# Altium schematic sheet [04] - SERVO DRIVER.SchDoc
size A4; DocumentNumber: 4; SheetNumber: 4; SheetTotal: 5; Folha: Servo Driver
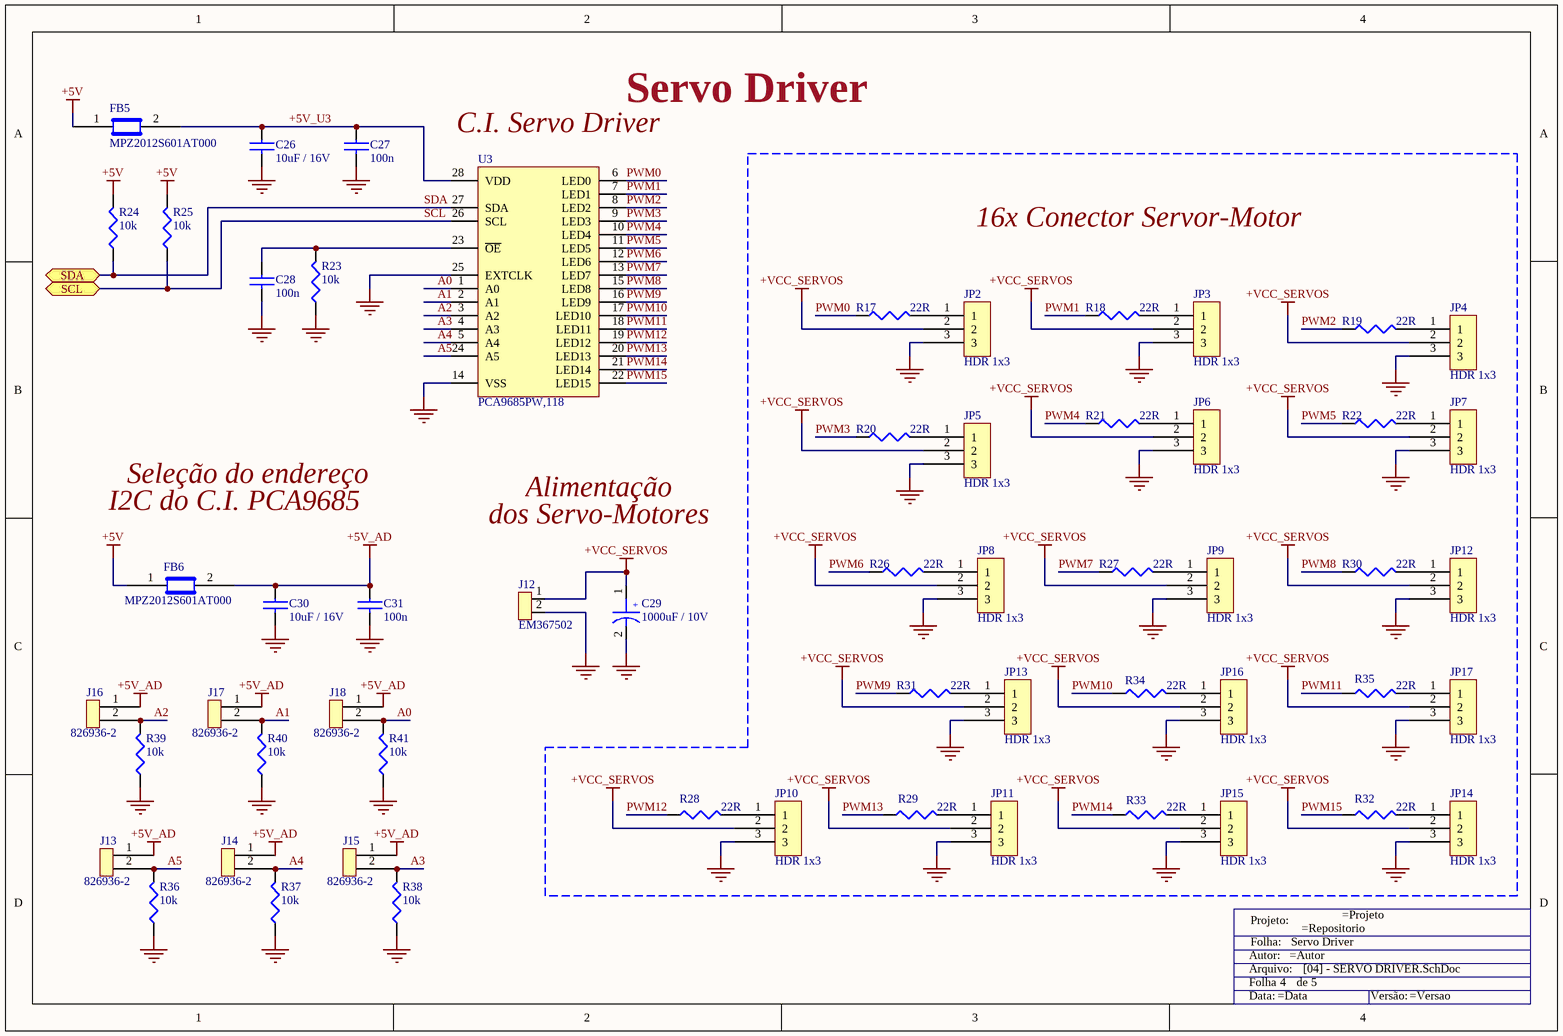
[diagram p0: [04] - SERVO DRIVER.SchDoc]

## Parts
C26  10uF / 16V  [C0805]
C27  100n  [C0805]
C28  100n  [C0805]
C29  1000uF / 10V  [CAP_EL_10MMX16]
C30  10uF / 16V  [C0805]
C31  100n  [C0805]
FB5  MPZ2012S601AT000  [C0805]
FB6  MPZ2012S601AT000  [C0805]
J12  EM367502  [2_Pins_Fixed_Terminal]
J13  826936-2  [HDR_1X2_2.54MM]
J14  826936-2  [HDR_1X2_2.54MM]
J15  826936-2  [HDR_1X2_2.54MM]
J16  826936-2  [HDR_1X2_2.54MM]
J17  826936-2  [HDR_1X2_2.54MM]
J18  826936-2  [HDR_1X2_2.54MM]
JP2  HDR 1x3  [Hdr_1x3_2.54mm]
JP3  HDR 1x3  [Hdr_1x3_2.54mm]
JP4  HDR 1x3  [Hdr_1x3_2.54mm]
JP5  HDR 1x3  [Hdr_1x3_2.54mm]
JP6  HDR 1x3  [Hdr_1x3_2.54mm]
JP7  HDR 1x3  [Hdr_1x3_2.54mm]
JP8  HDR 1x3  [Hdr_1x3_2.54mm]
JP9  HDR 1x3  [Hdr_1x3_2.54mm]
JP10  HDR 1x3  [Hdr_1x3_2.54mm]
JP11  HDR 1x3  [Hdr_1x3_2.54mm]
JP12  HDR 1x3  [Hdr_1x3_2.54mm]
JP13  HDR 1x3  [Hdr_1x3_2.54mm]
JP14  HDR 1x3  [Hdr_1x3_2.54mm]
JP15  HDR 1x3  [Hdr_1x3_2.54mm]
JP16  HDR 1x3  [Hdr_1x3_2.54mm]
JP17  HDR 1x3  [Hdr_1x3_2.54mm]
R17  22R  [R0805]
R18  22R  [R0805]
R19  22R  [R0805]
R20  22R  [R0805]
R21  22R  [R0805]
R22  22R  [R0805]
R23  10k  [R0805]
R24  10k  [R0805]
R25  10k  [R0805]
R26  22R  [R0805]
R27  22R  [R0805]
R28  22R  [R0805]
R29  22R  [R0805]
R30  22R  [R0805]
R31  22R  [R0805]
R32  22R  [R0805]
R33  22R  [R0805]
R34  22R  [R0805]
R35  22R  [R0805]
R36  10k  [R0805]
R37  10k  [R0805]
R38  10k  [R0805]
R39  10k  [R0805]
R40  10k  [R0805]
R41  10k  [R0805]
TitleBlock4  Title Block  (value not drawn)  (graphical)
U3  PCA9685PW,118  [TSSOP28]

## Ports
SCL (bidir), SDA (bidir)

## Nets
+5V: FB5.1 FB6.1 R24.2 R25.2
+5V_AD: C30.1 C31.1 FB6.2 J13.1 J14.1 J15.1 J16.1 J17.1 J18.1
+VCC_SERVOS: C29.1 J12.1 JP2.2 JP3.2 JP4.2 JP5.2 JP6.2 JP7.2 JP8.2 JP9.2 JP10.2 JP11.2 JP12.2 JP13.2 JP14.2 JP15.2 JP16.2 JP17.2
GND: C26.2 C27.2 C28.2 C29.2 C30.2 C31.2 J12.2 JP2.3 JP3.3 JP4.3 JP5.3 JP6.3 JP7.3 JP8.3 JP9.3 JP10.3 JP11.3 JP12.3 JP13.3 JP14.3 JP15.3 JP16.3 JP17.3 R23.1 R36.1 R37.1 R38.1 R39.1 R40.1 R41.1 U3.14(VSS) U3.25(EXTCLK)
+5V_U3: C26.1 C27.1 FB5.2 U3.28(VDD)
A0: J18.2 R41.2 U3.1(A0)
A1: J17.2 R40.2 U3.2(A1)
A2: J16.2 R39.2 U3.3(A2)
A3: J15.2 R38.2 U3.4(A3)
A4: J14.2 R37.2 U3.5(A4)
A5: J13.2 R36.2 U3.24(A5)
PWM0: R17.1 U3.6(LED0)
PWM1: R18.1 U3.7(LED1)
PWM2: R19.1 U3.8(LED2)
PWM3: R20.1 U3.9(LED3)
PWM4: R21.1 U3.10(LED4)
PWM5: R22.1 U3.11(LED5)
PWM6: R26.1 U3.12(LED6)
PWM7: R27.1 U3.13(LED7)
PWM8: R30.1 U3.15(LED8)
PWM9: R31.1 U3.16(LED9)
PWM10: R34.1 U3.17(LED10)
PWM11: R35.1 U3.18(LED11)
PWM12: R28.1 U3.19(LED12)
PWM13: R29.1 U3.20(LED13)
PWM14: R33.1 U3.21(LED14)
PWM15: R32.1 U3.22(LED15)
SCL: R25.1 U3.26(SCL) ; port SCL
SDA: R24.1 U3.27(SDA) ; port SDA
NetC28_1: C28.1 R23.2 U3.23(~{OE})
NetJP2_1: JP2.1 R17.2
NetJP3_1: JP3.1 R18.2
NetJP4_1: JP4.1 R19.2
NetJP5_1: JP5.1 R20.2
NetJP6_1: JP6.1 R21.2
NetJP7_1: JP7.1 R22.2
NetJP8_1: JP8.1 R26.2
NetJP9_1: JP9.1 R27.2
NetJP10_1: JP10.1 R28.2
NetJP11_1: JP11.1 R29.2
NetJP12_1: JP12.1 R30.2
NetJP13_1: JP13.1 R31.2
NetJP14_1: JP14.1 R32.2
NetJP15_1: JP15.1 R33.2
NetJP16_1: JP16.1 R34.2
NetJP17_1: JP17.1 R35.2

## Notes on the sheet
- Servo Driver
- (near U3) C.I. Servo Driver
- 16x Conector Servor-Motor
- I2C do C.I. PCA9685
- Seleção do endereço
- Alimentação
- dos Servo-Motores
- (in symbol EKZE100ELL102MJ16S) +
- (in symbol Title Block) Projeto:; Folha:; Autor:; Arquivo:; Folha; de; Data:; Versão:

## Library data of the parts
C26 C30 = C2012X5R1C106M125AC: CAP CER 10UF 16V X5R 0805; Manufacturer: TDK Corporation; Capacitance: 10µF; Tolerance: ±20%; Supplier 1: Digi-Key; Manufacturer Part Number: C2012X5R1C106M125AC; RoHS: RoHS Compliant; Category: Capacitors; Stock 1: 72024; Pricing 1: 1=0.33, 10=0.272, 100=0.136, 250=0.102, 500=0.0901, 1000=0.0799 (USD); Packaging: Cut Tape (CT); Voltage - Rated: 16V; Temperature Coefficient: X5R; Mounting Type: Surface Mount, MLCC; Operating Temperature: -55°C ~ 85°C; Applications: General Purpose; Ratings: -; Package / Case: 0805 (2012 Metric); Size / Dimension: 0.079" L x 0.049" W (2.00mm x 1.25mm); Height - Seated (Max): -; Thickness (Max): 0.057" (1.45mm); Lead Spacing: -; Features: -; Lead Style: -; ComponentLink1URL: https://product.tdk.com/info/en/catalog/datasheets/mlcc_commercial_general_en.pdf; ComponentLink1Description: https://product.tdk.com/info/en/catalog/datasheets/mlcc_commercial_general_en.pdf; Supplier Part Number 1: 445-4115-1-ND
C27 C28 C31 = C2012X7R1H104K085AA_1: CAP CER 0.1UF 50V X7R 0805; Manufacturer: TDK Corporation; Capacitance: 0.1µF; Tolerance: ±10%; Supplier 1: Digi-Key; Manufacturer Part Number: C2012X7R1H104K085AA; RoHS: RoHS Compliant; Category: Capacitors; Stock 1: 335513; Pricing 1: 1=0.1, 10=0.066, 100=0.0303, 250=0.02476, 500=0.02118, 1000=0.0165 (USD); Packaging: Cut Tape (CT); Voltage - Rated: 50V; Temperature Coefficient: X7R; Mounting Type: Surface Mount, MLCC; Operating Temperature: -55°C ~ 125°C; Applications: General Purpose; Ratings: -; Package / Case: 0805 (2012 Metric); Size / Dimension: 0.079" L x 0.049" W (2.00mm x 1.25mm); Height - Seated (Max): -; Thickness (Max): 0.037" (0.95mm); Lead Spacing: -; Features: -; Lead Style: -; ComponentLink1URL: https://product.tdk.com/info/en/catalog/datasheets/mlcc_commercial_general_en.pdf; ComponentLink1Description: https://product.tdk.com/info/en/catalog/datasheets/mlcc_commercial_general_en.pdf; Supplier Part Number 1: 445-7534-1-ND
C29 = EKZE100ELL102MJ16S: Aluminum Electrolytic Capacitors - Leaded 10volts 1000uF 10X16; Manufacturer: United Chemi-Con; Tolerance: 20 %; Voltage Rating DC: 10 VDC; Supplier 1: Mouser; Manufacturer Part Number: EKZE100ELL102MJ16S; RoHS: RoHS Compliant; Category: Aluminum Electrolytic Capacitors - Leaded; Stock 1: 9583; Pricing 1: 1=0.720, 10=0.508, 100=0.335, 500=0.248, 1000=0.211, 2000=0.199, 4000=0.186, 10000=0.174, 24000=0.168 (USD); Capacitance: 1000 uF; Diameter: 10 mm; Length: 16 mm; Packaging: Bulk; Product: Low Impedance Electrolytic Capacitors; Series: KZE; Termination Style: Radial; Brand: United Chemi-Con; Lead Spacing: 5 mm; Maximum Operating Temperature: + 105 C; Minimum Operating Temperature: - 40 C; Standard Pack Qty: 2000; RoHS - Mouser: Y; Minimum Order Quantity: 1; Reeling: False; ComponentLink1URL: http://www.mouser.com/ds/2/420/-794851.pdf; ComponentLink1Description: http://www.mouser.com/ds/2/420/-794851.pdf; Supplier Part Number 1: 661-EKZE100ELL102MJ1
FB5 FB6 = MPZ2012S601AT000: FERRITE CHIP BEAD 600 OHM SMD; Manufacturer: TDK Corporation; Impedance @ Frequency: 600 Ohm @ 100MHz; Current Rating: 2A; DC Resistance (DCR): 100 mOhm Max; Filter Type: Differential Mode - Single; Supplier 1: Digi-Key; Manufacturer Part Number: MPZ2012S601AT000; RoHS: RoHS Compliant; Category: Filters; Stock 1: 93838; Pricing 1: 1=0.12, 10=0.101, 100=0.0574, 250=0.04528, 500=0.03824, 1000=0.03221 (USD); Packaging: Cut Tape (CT); Package / Case: 0805 (2012 Metric); Mounting Type: Surface Mount; Height (Max): 0.041" (1.05mm); Size / Dimension: 0.079" L x 0.049" W (2.00mm x 1.25mm); ComponentLink1URL: https://product.tdk.com/info/en/catalog/datasheets/beads_commercial_power_mpz2012_en.pdf; ComponentLink1Description: https://product.tdk.com/info/en/catalog/datasheets/beads_commercial_power_mpz2012_en.pdf; Supplier Part Number 1: 445-2206-1-ND
J12 = EM367502: Fixed Terminal Blocks EURO (MA311-50002) TERM; Manufacturer: Bussmann / Eaton; Connection Method: Spring Cage; Current Rating: 10 A; Mounting Angle: Vertical; Number of Positions: 2 Position; Voltage Rating: 300 V; Pitch: 5 mm; Wire Gauge Range: 26 AWG to 14 AWG; Supplier 1: Mouser; Manufacturer Part Number: EM367502; RoHS: RoHS Compliant; Category: Fixed Terminal Blocks; Stock 1: 1498; Pricing 1: 1=0.260, 10=0.250, 100=0.240, 250=0.226, 500=0.214, 1000=0.203, 2000=0.190, 5000=0.179, 10000=0.164 (USD); Color: Green; Contact Plating: Tin; Housing Material: Thermoplastic; Packaging: Bulk; Product: Fixed Terminal Blocks; Series: EM3675; Termination Style: Through Hole; Brand: Bussmann / Eaton; Contact Material: Brass; Flammability Rating: UL 94 V-0; Standard Pack Qty: 100; Tradename: EuroMag; RoHS - Mouser: Y; Minimum Order Quantity: 1; Reeling: False; ComponentLink1URL: http://www.mouser.com/ds/2/87/Bus_Elx_DS_EM3675_Spring_Clamp-1066360.pdf; ComponentLink1Description: http://www.mouser.com/ds/2/87/Bus_Elx_DS_EM3675_Spring_Clamp-1066360.pdf; Supplier Part Number 1: 504-EM367502
J13-J18 = 826936-2: Headers & Wire Housings 2P SINGLE ROW; Manufacturer: TE Connectivity; Mounting Angle: Vertical; Number of Positions: 2 Position; Pitch: 2.54 mm; Mating Post Length: 5.8 mm; Supplier 1: Mouser; Manufacturer Part Number: 826936-2; RoHS: RoHS Compliant; Category: Headers & Wire Housings; Stock 1: 5764; Pricing 1: 1=0.100, 25=0.090, 50=0.086, 100=0.082, 500=0.075, 1000=0.072 (USD); Contact Plating: Tin; Housing Material: Thermoplastic; Number of Rows: 1 Row; Packaging: Bulk; Product: Headers; Series: AMPMODU MOD II; Termination Style: Through Hole; Type: Breakaway; Brand: TE Connectivity; Contact Material: Brass; Flammability Rating: UL 94 V-0; Mounting Style: -; Row Spacing: 2.54 mm; Contact Gender: Pin (Male); Standard Pack Qty: 3000; Termination Post Length: 3.2 mm; Tradename: AMPMODU; RoHS - Mouser: Y; Minimum Order Quantity: 1; Reeling: False; ComponentLink1URL: http://www.mouser.com/ds/2/418/NG_CD_826629_AC-673032.pdf; ComponentLink1Description: http://www.mouser.com/ds/2/418/NG_CD_826629_AC-673032.pdf; Supplier Part Number 1: 571-826936-2
JP2-JP17 = 68000-103HLF: BERGSTIK II .100" SR STRAIGHT; Manufacturer: FCI; Connector Type: Header, Unshrouded; Number of Positions: 3; Number of Positions Loaded: All; Pitch: 0.100" (2.54mm); Supplier 1: Digi-Key; Manufacturer Part Number: 68000-103HLF; RoHS: RoHS Compliant; Category: Connectors, Interconnects; Stock 1: 54154; Pricing 1: 1=0.26, 10=0.249, 25=0.2136, 50=0.1816, 100=0.1744, 250=0.15664, 500=0.14952, 1000=0.1246, 2500=0.11392 (USD); Packaging: Bulk; Contact Type: Male Pin; Number of Rows: 1; Row Spacing: -; Contact Mating Length: 0.230" (5.84mm); Mounting Type: Through Hole; Termination: Solder; Fastening Type: -; Features: -; Contact Finish: Gold or Gold, GXT™; Contact Finish Thickness: 30µin (0.76µm); Color: Black; ComponentLink1URL: http://portal.fciconnect.com/Comergent//fci/drawing/68000.pdf; ComponentLink1Description: http://portal.fciconnect.com/Comergent//fci/drawing/68000.pdf; Supplier Part Number 1: 609-3461-ND
R17-R22 R26-R35 = RC0805FR-0722RL: RES SMD 22 OHM 1% 1/8W 0805; Manufacturer: Yageo; Resistance (Ohms): 22; Power (Watts): 0.125W, 1/8W; Temperature Coefficient: ±100ppm/°C; Supplier 1: Digi-Key; Manufacturer Part Number: RC0805FR-0722RL; RoHS: RoHS Compliant; Category: Resistors; Stock 1: 106658; Pricing 1: 1=0.1, 10=0.021, 25=0.0152, 100=0.0084, 250=0.00644, 500=0.00514, 1000=0.00379, 2500=0.00329 (USD); Packaging: Cut Tape (CT); Tolerance: ±1%; Composition: Thick Film; Features: Moisture Resistant; Operating Temperature: -55°C ~ 155°C; Package / Case: 0805 (2012 Metric); Supplier Device Package: 0805; Size / Dimension: 0.079" L x 0.049" W (2.00mm x 1.25mm); Height: 0.024" (0.60mm); Number of Terminations: 2; ComponentLink1URL: http://www.yageo.com/NewPortal/yageodocoutput?fileName=/pdf/R-Chip/PYu-RC_Group_51_RoHS_L_3.pdf; ComponentLink1Description: http://www.yageo.com/NewPortal/yageodocoutput?fileName=/pdf/R-Chip/PYu-RC_Group_51_RoHS_L_3.pdf; Supplier Part Number 1: 311-22.0CRCT-ND
R23-R25 R36-R41 = RC0805FR-0710KL: RES SMD 10K OHM 1% 1/8W 0805; Manufacturer: Yageo; Power (Watts): 0.125W, 1/8W; Temperature Coefficient: ±100ppm/°C; Supplier 1: Digi-Key; Manufacturer Part Number: RC0805FR-0710KL; RoHS: RoHS Compliant; Category: Resistors; Stock 1: 4526802; Pricing 1: 1=0.1, 10=0.021, 25=0.0152, 100=0.0084, 250=0.00644, 500=0.00514, 1000=0.00379, 2500=0.00329 (USD); Packaging: Cut Tape (CT); Resistance (Ohms): 10k; Tolerance: ±1%; Composition: Thick Film; Features: Moisture Resistant; Operating Temperature: -55°C ~ 155°C; Package / Case: 0805 (2012 Metric); Supplier Device Package: 0805; Size / Dimension: 0.079" L x 0.049" W (2.00mm x 1.25mm); Height: 0.024" (0.60mm); Number of Terminations: 2; ComponentLink1URL: http://www.yageo.com/NewPortal/yageodocoutput?fileName=/pdf/R-Chip/PYu-RC_Group_51_RoHS_L_3.pdf; ComponentLink1Description: http://www.yageo.com/NewPortal/yageodocoutput?fileName=/pdf/R-Chip/PYu-RC_Group_51_RoHS_L_3.pdf; Supplier Part Number 1: 311-10.0KCRCT-ND
U3 = PCA9685PW118: LED Display Drivers I2C Bus LED Controller 28-Pin; Manufacturer: NXP Semiconductors; Supplier 1: Mouser; Manufacturer Part Number: PCA9685PW,118; RoHS: RoHS Compliant; Category: LED Display Drivers; Stock 1: 6865; Pricing 1: 1=2.24, 10=1.90, 100=1.52, 500=1.34, 1000=1.11, 2500=1.03, 5000=0.989, 10000=0.950 (USD); Packaging: Cut Tape; Series: PCA9685; Brand: NXP Semiconductors; Standard Pack Qty: 2500; RoHS - Mouser: Y; Minimum Order Quantity: 1; Reeling: True; ComponentLink1URL: http://www.mouser.com/ds/2/302/PCA9685-1127478.pdf; ComponentLink1Description: http://www.mouser.com/ds/2/302/PCA9685-1127478.pdf; Supplier Part Number 1: 771-PCA9685PW,118